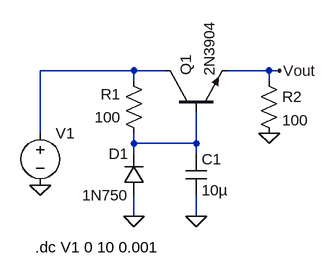
[diagram p0: schematic 09A-14.asc]
09A-14.asc, the LTspice schematic file:
Version 4.1
SHEET 1 880 680
WIRE 256 32 112 32
WIRE 304 32 256 32
WIRE 464 32 400 32
WIRE 480 32 464 32
WIRE 256 48 256 32
WIRE 464 48 464 32
WIRE 112 128 112 32
WIRE 256 144 256 128
WIRE 352 144 352 96
WIRE 352 144 256 144
WIRE 256 160 256 144
WIRE 352 160 352 144
WIRE 256 256 256 224
WIRE 352 256 352 224
FLAG 256 256 0
FLAG 352 256 0
FLAG 112 208 0
FLAG 480 32 Vout
FLAG 464 128 0
SYMBOL voltage 112 112 R0
WINDOW 123 0 0 Left 0
WINDOW 39 0 0 Left 0
SYMATTR InstName V1
SYMATTR Value ""
SYMBOL res 272 144 R180
WINDOW 0 36 76 Left 2
WINDOW 3 36 40 Left 2
SYMATTR InstName R1
SYMATTR Value 100
SYMBOL diode 272 224 R180
WINDOW 0 24 64 Left 2
WINDOW 3 24 0 Left 2
SYMATTR InstName D1
SYMATTR Value 1N750
SYMATTR Description Diode
SYMATTR Type diode
SYMBOL cap 336 160 R0
SYMATTR InstName C1
SYMATTR Value 10µ
SYMBOL npn 304 96 R270
SYMATTR InstName Q1
SYMATTR Value 2N3904
SYMBOL res 448 32 R0
SYMATTR InstName R2
SYMATTR Value 100
TEXT 104 304 Left 2 !.dc V1 0 10 0.001

The netlist it stands for:
* 09A-14.asc
V1 N001 0
R1 N002 N001 100
D1 0 N002 1N750
C1 N002 0 10µ
Q1 N001 N002 Vout 0 2N3904
R2 Vout 0 100
.model D D
.lib standard.dio
.model NPN NPN
.model PNP PNP
.lib standard.bjt
.dc V1 0 10 0.001
.backanno
.end